# Altium schematic sheet CC2530-Board.SchDoc
size A4
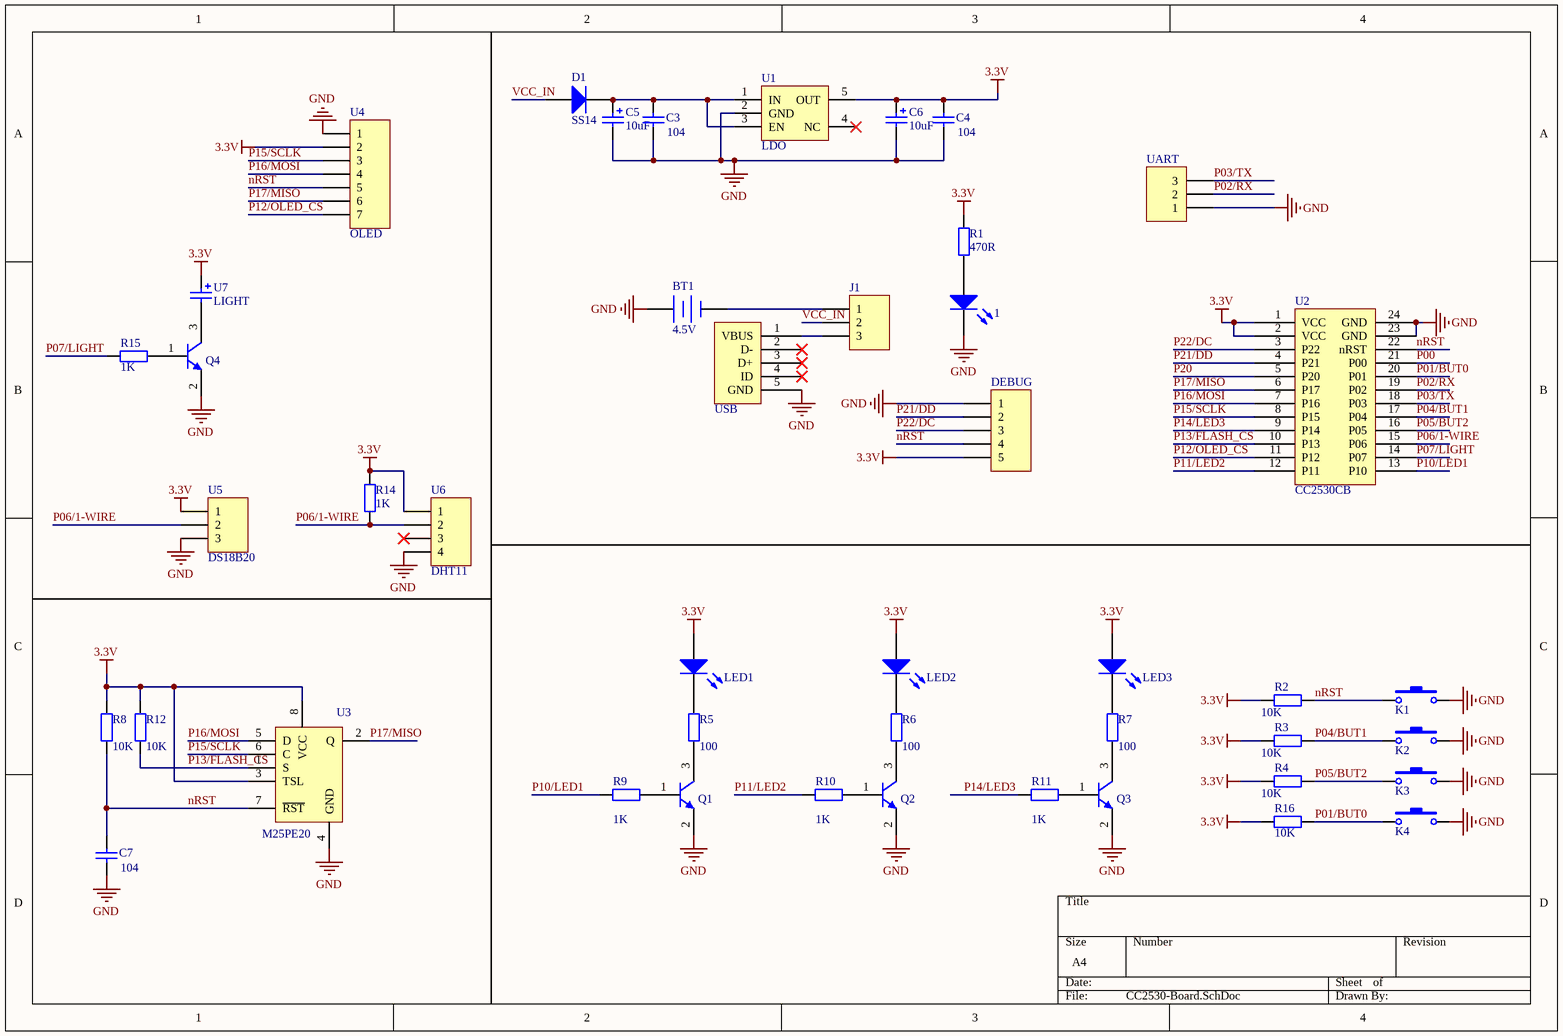
[diagram p0: CC2530-Board.SchDoc]

## Parts
1  LED_SMD  [0603]  (value not drawn)
2  USB  [MINI-USB]
BT1  4.5V  [BAT-2]
C3  value 104  [0603]
C4  value 104  [0603]
C5  10uF  [C-1210]
C6  10uF  [C-1210]
C7  value 104  [0603]
D1  SS14  [SS14]
DEBUG  (no value)  [HDR1X5]
J1  Header 3  [Key-7Pin]  (value not drawn)
K1  Mini-Key  [MINI-KEY]  (value not drawn)
K2  Mini-Key  [MINI-KEY]  (value not drawn)
K3  Mini-Key  [MINI-KEY]  (value not drawn)
K4  Mini-Key  [MINI-KEY]  (value not drawn)
LED1  LED_SMD  [0603]  (value not drawn)
LED2  LED_SMD  [0603]  (value not drawn)
LED3  LED_SMD  [0603]  (value not drawn)
Q1  NPN_SMD  [SOT23-3]  (value not drawn)
Q2  NPN_SMD  [SOT23-3]  (value not drawn)
Q3  NPN_SMD  [SOT23-3]  (value not drawn)
Q4  NPN_SMD  [SOT23-3]  (value not drawn)
R1  value 470R  [0603]
R2  value 10K  [0603]
R3  value 10K  [0603]
R4  value 10K  [0603]
R5  value 100  [0603]
R6  value 100  [0603]
R7  value 100  [0603]
R8  value 10K  [0603]
R9  value 1K  [0603]
R10  value 1K  [0603]
R11  value 1K  [0603]
R12  value 10K  [0603]
R14  value 1K  [0603]
R15  value 1K  [0603]
R16  value 10K  [0603]
U1  LDO  [SOT23-5]
U2  CC2530CB  [CC2530CB]
U3  M25PE20  [M25PE20]
U4  OLED  [OLED-0.96]
U5  DS18B20  [MHDR1X3]
U6  DHT11  [HDR1X4]
U7  LIGHT  [C-1210]
UART  Header 3  [HDR1X3]  (value not drawn)

## Nets
3.3V: C4.2 C6.1 DEBUG.5 LED1.1(A) LED2.1(A) LED3.1(A) R1.2 R2.2 R3.2 R4.2 R8.2 R12.2 R14.2 R16.2 U1.5(OUT) U2.1(VCC) U2.2(VCC) U3.3(TSL) U3.8(VCC) U4.2 U5.1 U6.1 U7.1
GND: 1.2(K) 2.5(GND) BT1.1(+) C3.1 C4.1 C5.2 C6.2 C7.1 DEBUG.1 K1.2 K2.2 K3.2 K4.2 Q1.2(E) Q2.2(E) Q3.2(E) Q4.2(E) U1.2(GND) U2.23(GND) U2.24(GND) U3.4(GND) U4.1 U5.3 U6.4 UART.1
nRST: C7.2 DEBUG.4 K1.1 R2.1 R8.1 U2.22(nRST) U3.7(~{RST}) U4.5
P00: U2.21(P00)
P01/BUT0: K4.1 R16.1 U2.20(P01)
P02/RX: U2.19(P02) UART.2
P03/TX: U2.18(P03) UART.3
P04/BUT1: K2.1 R3.1 U2.17(P04)
P05/BUT2: K3.1 R4.1 U2.16(P05)
P06/1-WIRE: R14.1 U2.15(P06) U5.2 U6.2
P07/LIGHT: R15.2 U2.14(P07)
P10/LED1: R9.1 U2.13(P10)
P11/LED2: R10.1 U2.12(P11)
P12/OLED_CS: U2.11(P12) U4.7
P13/FLASH_CS: R12.1 U2.10(P13) U3.1(S)
P14/LED3: R11.1 U2.9(P14)
P15/SCLK: U2.8(P15) U3.6(C) U4.3
P16/MOSI: U2.7(P16) U3.5(D) U4.4
P17/MISO: U2.6(P17) U3.2(Q) U4.6
P20: U2.5(P20)
P21/DD: DEBUG.2 U2.4(P21)
P22/DC: DEBUG.3 U2.3(P22)
VCC_IN: D1.1(A) J1.2
Net1_1: 1.1(A) R1.1
Net2_1: 2.1(VBUS) J1.3
NetBT1_2: BT1.2(-) J1.1
NetC3_2: C3.2 C5.1 D1.2(K) U1.1(IN) U1.3(EN)
NetLED1_2: LED1.2(K) R5.2
NetLED2_2: LED2.2(K) R6.2
NetLED3_2: LED3.2(K) R7.2
NetQ1_1: Q1.1(B) R9.2
NetQ1_3: Q1.3(C) R5.1
NetQ2_1: Q2.1(B) R10.2
NetQ2_3: Q2.3(C) R6.1
NetQ3_1: Q3.1(B) R11.2
NetQ3_3: Q3.3(C) R7.1
NetQ4_1: Q4.1(B) R15.1
NetQ4_3: Q4.3(C) U7.2

Not connected (* = marked no-connect by the designer): 2 2(D-)* 3(D+)* 4(ID)*; U1 4(NC)*; U6 3*

## Library data of the parts
1 LED1-LED3 = LED_0805
2 = Mini_USB
BT1 = Battery: Multicell Battery; Published: 24-Mar-1999; LatestRevisionDate: 17-Jul-2002; LatestRevisionNote: Re-released for DXP Platform.; PackageReference: BAT-2; Publisher: Altium Limited
C3 C4 C7 = C_0805
C5 C6 U7 = Cap Pol: Polarized Capacitor (Radial); Published: 8-Jun-2000; LatestRevisionDate: 17-Jul-2002; LatestRevisionNote: Re-released for DXP Platform.; Publisher: Altium Limited
D1 = Diode: Default Diode; Published: 8-Jun-2000; LatestRevisionDate: 17-Jul-2002; LatestRevisionNote: Re-released for DXP Platform.; PackageDocument: Sep-1996; PackageReference: SMC; Publisher: Altium Limited; Code_JEDEC: DO-214-AB
DEBUG = Header 5: Header, 5-Pin; LatestRevisionDate: 17-Jul-2002; LatestRevisionNote: Re-released for DXP Platform.; Publisher: Altium Limited
J1 UART = Header 3: Header, 3-Pin; LatestRevisionDate: 17-Jul-2002; LatestRevisionNote: Re-released for DXP Platform.; Publisher: Altium Limited
Q1-Q4 = NPN_SMD: NPN Bipolar Transistor; Published: 8-Jun-2000; LatestRevisionDate: 17-Jul-2002; LatestRevisionNote: Re-released for DXP Platform.; PackageReference: TO-226; Publisher: Altium Limited; Code_JEDEC: TO-226-AA
R1-R12 R14-R16 = R_0805
U1 = LDO-3.3
U4 = Header 7: Header, 7-Pin; LatestRevisionDate: 17-Jul-2002; LatestRevisionNote: Re-released for DXP Platform.; Publisher: Altium Limited
U5 = MHDR1X3: Header, 3-Pin; LatestRevisionDate: 17-Jul-2002; LatestRevisionNote: Re-released for DXP Platform.; Publisher: Altium Limited
U6 = Header 4: Header, 4-Pin; LatestRevisionDate: 17-Jul-2002; LatestRevisionNote: Re-released for DXP Platform.; Publisher: Altium Limited